# Altium schematic sheet OSSI-1 OBC_2.SchDoc: TITLE:
size 410 x 286 mm; Date: Date:; >LAST_DATE_TIME: 01/11/2015 13:38:44; Sheet:: Sheet:; >SHEET: 3; REV:: REV:; Document Number:: Document Number:; >DRAWING_NAME: OSSI-1 OBC.sch
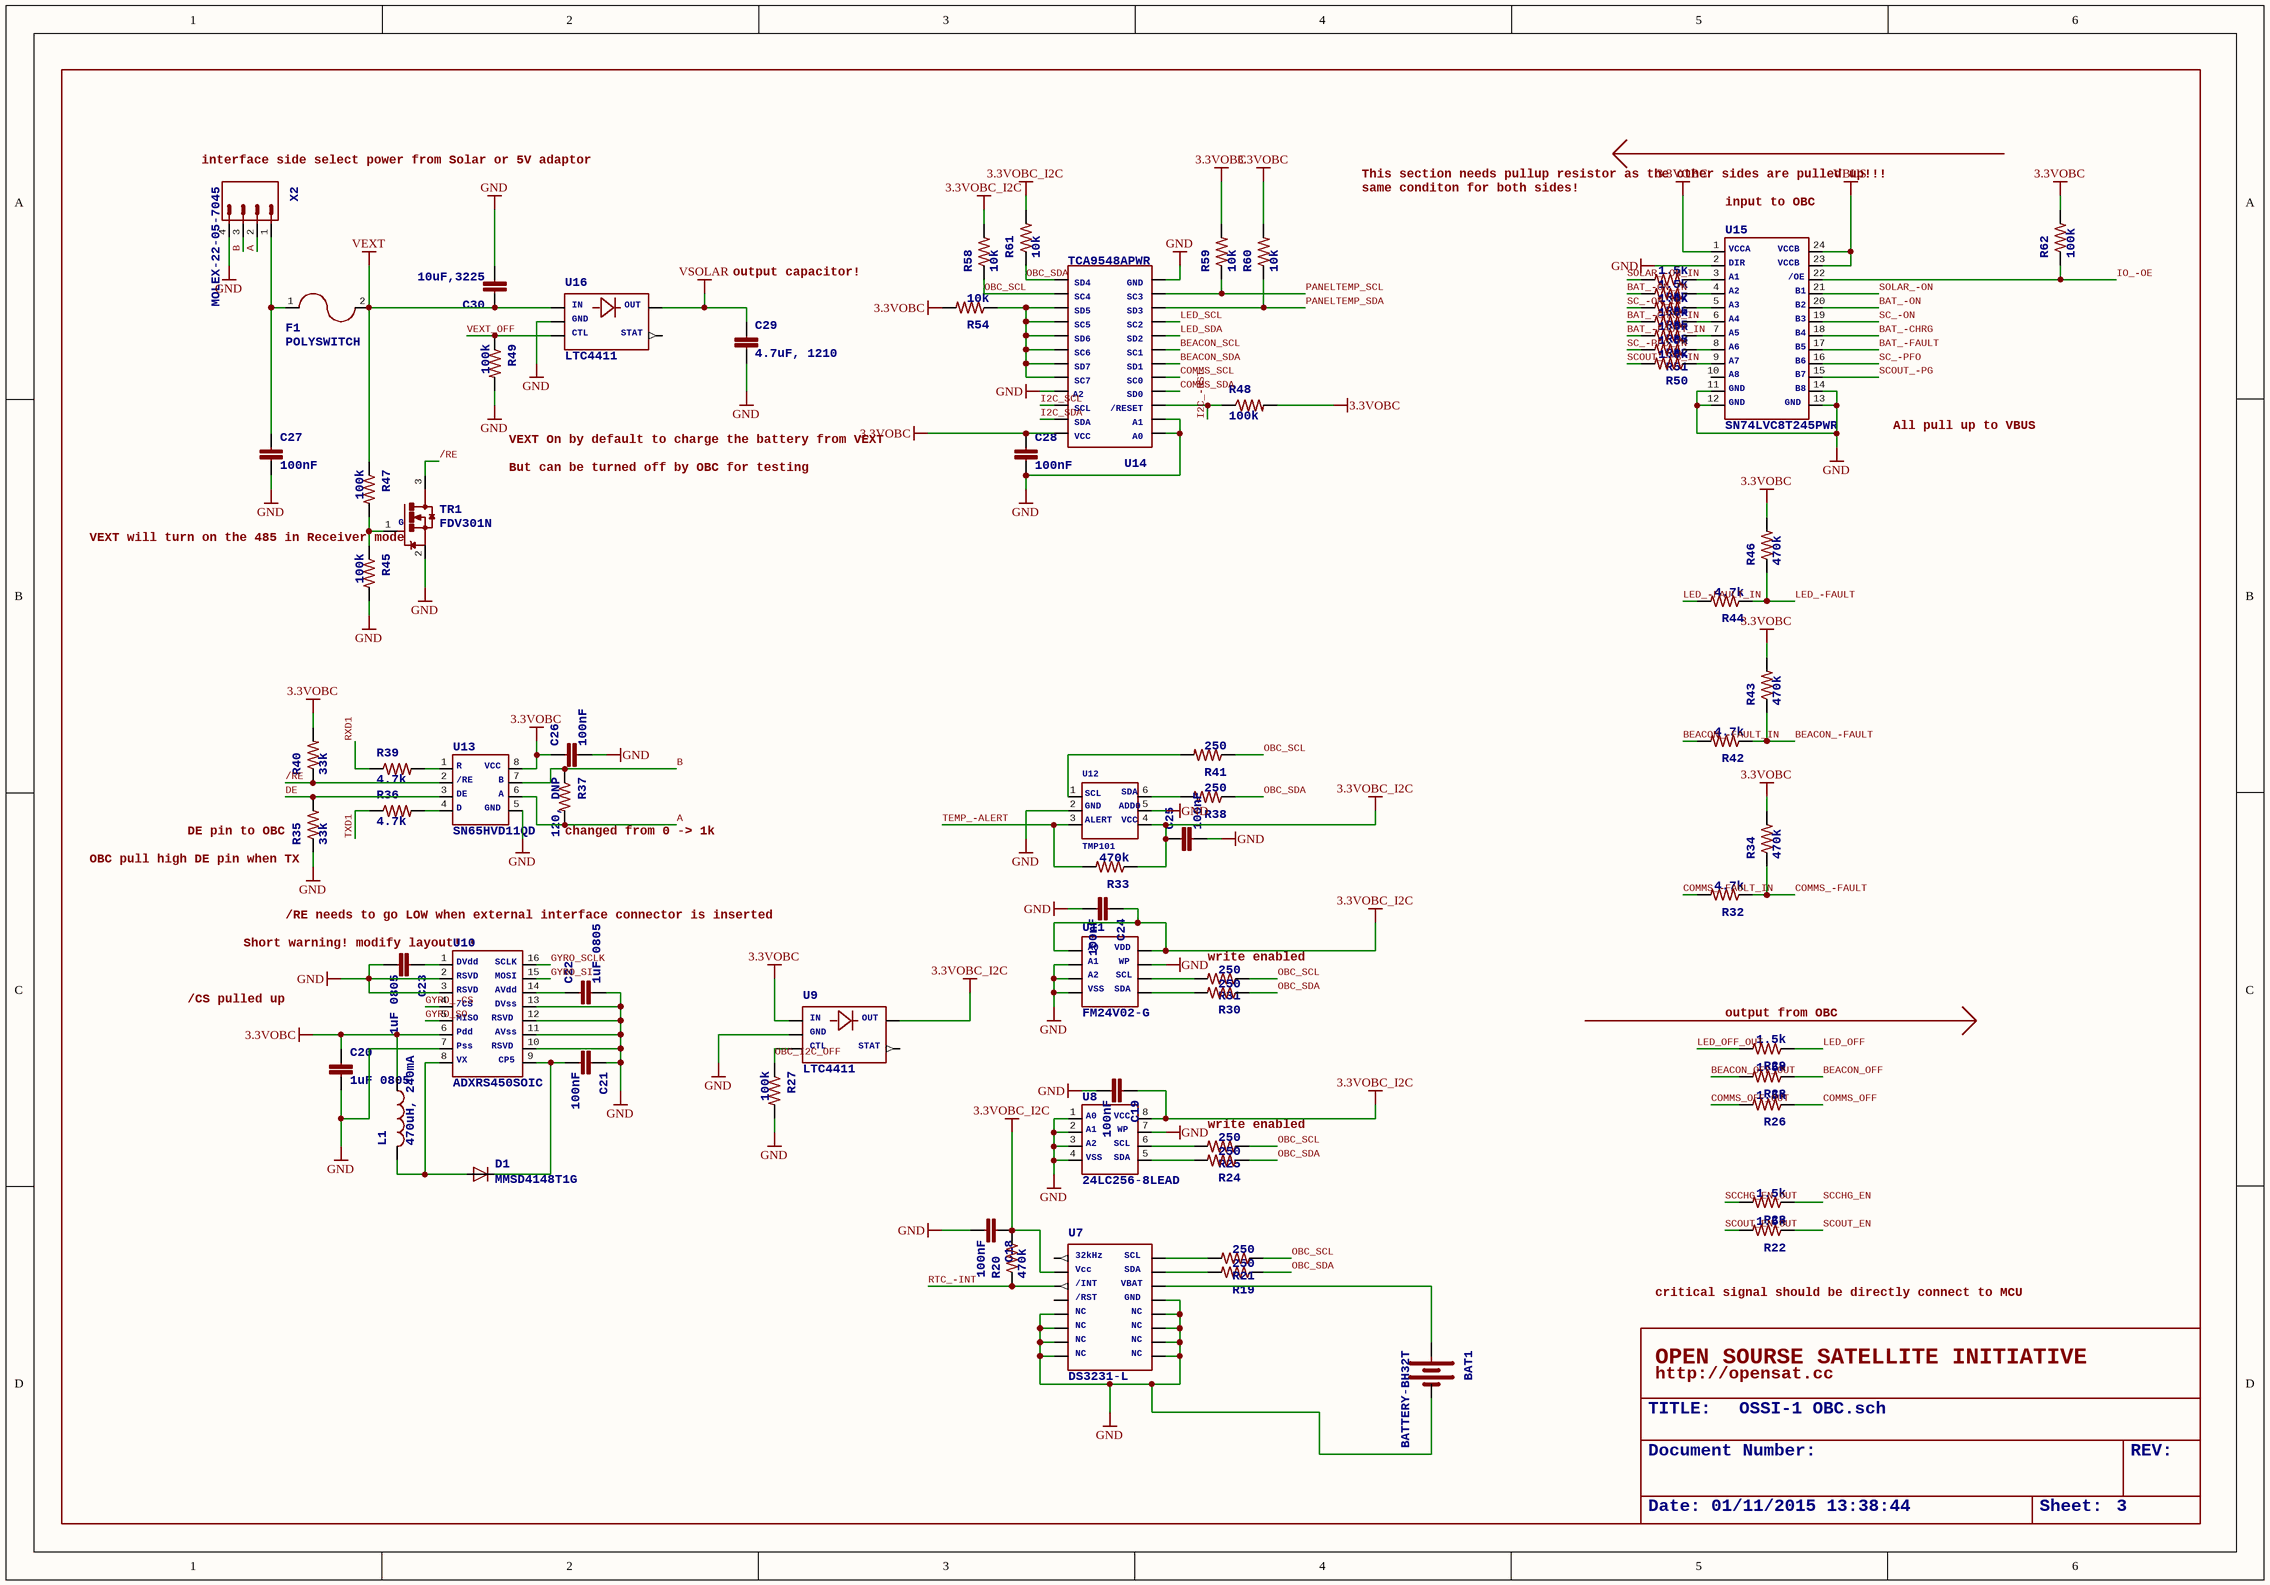
[diagram p0: OSSI-1 OBC_2.SchDoc]

## Parts
BAT1  >NAME: BAT1  [BH32T-C-G]  (hidden comment: BATTERY-BH32T)
C18  >NAME: C18  [C0603(1608)]  (hidden comment: 100nF)
C19  >NAME: C19  [C0603(1608)]  (hidden comment: 100nF)
C20  >NAME: C20  [C0805(2012)]  (hidden comment: 1uF 0805)
C21  >NAME: C21  [C0603(1608)]  (hidden comment: 100nF)
C22  >NAME: C22  [C0805(2012)]  (hidden comment: 1uF 0805)
C23  >NAME: C23  [C0805(2012)]  (hidden comment: 1uF 0805)
C24  >NAME: C24  [C0603(1608)]  (hidden comment: 100nF)
C25  >NAME: C25  [C0603(1608)]  (hidden comment: 100nF)
C26  >NAME: C26  [C0603(1608)]  (hidden comment: 100nF)
C27  >NAME: C27  [C0603(1608)]  (hidden comment: 100nF)
C28  >NAME: C28  [C0603(1608)]  (hidden comment: 100nF)
C29  >NAME: C29  [C1206-GCM31]  (hidden comment: 4.7uF, 1210)
C30  >NAME: C30  [C1210-GCM32]  (hidden comment: 10uF,3225)
D1  >NAME: D1  [SOD-123]  (hidden comment: MMSD4148T1G)
F1  >NAME: F1  [NANOSMDC150FCT]  (hidden comment: POLYSWITCH)
L1  >NAME: L1  [L(2220)]  (hidden comment: 470uH, 240mA)
R19  >NAME: R19  [R0603(1608)]  (hidden comment: 250)
R20  >NAME: R20  [R0603(1608)]  (hidden comment: 470k)
R21  >NAME: R21  [R0603(1608)]  (hidden comment: 250)
R22  >NAME: R22  [R0603(1608)]  (hidden comment: 1.5k)
R23  >NAME: R23  [R0603(1608)]  (hidden comment: 1.5k)
R24  >NAME: R24  [R0603(1608)]  (hidden comment: 250)
R25  >NAME: R25  [R0603(1608)]  (hidden comment: 250)
R26  >NAME: R26  [R0603(1608)]  (hidden comment: 1.5k)
R27  >NAME: R27  [R0603(1608)]  (hidden comment: 100k)
R28  >NAME: R28  [R0603(1608)]  (hidden comment: 1.5k)
R29  >NAME: R29  [R0603(1608)]  (hidden comment: 1.5k)
R30  >NAME: R30  [R0603(1608)]  (hidden comment: 250)
R31  >NAME: R31  [R0603(1608)]  (hidden comment: 250)
R32  >NAME: R32  [R0603(1608)]  (hidden comment: 4.7k)
R33  >NAME: R33  [R0603(1608)]  (hidden comment: 470k)
R34  >NAME: R34  [R0603(1608)]  (hidden comment: 470k)
R35  >NAME: R35  [R0603(1608)]  (hidden comment: 33k)
R36  >NAME: R36  [R0603(1608)]  (hidden comment: 4.7k)
R37  >NAME: R37  [R0603(1608)]  (hidden comment: 120, DNP)
R38  >NAME: R38  [R0603(1608)]  (hidden comment: 250)
R39  >NAME: R39  [R0603(1608)]  (hidden comment: 4.7k)
R40  >NAME: R40  [R0603(1608)]  (hidden comment: 33k)
R41  >NAME: R41  [R0603(1608)]  (hidden comment: 250)
R42  >NAME: R42  [R0603(1608)]  (hidden comment: 4.7k)
R43  >NAME: R43  [R0603(1608)]  (hidden comment: 470k)
R44  >NAME: R44  [R0603(1608)]  (hidden comment: 4.7k)
R45  >NAME: R45  [R0603(1608)]  (hidden comment: 100k)
R46  >NAME: R46  [R0603(1608)]  (hidden comment: 470k)
R47  >NAME: R47  [R0603(1608)]  (hidden comment: 100k)
R48  >NAME: R48  [R0603(1608)]  (hidden comment: 100k)
R49  >NAME: R49  [R0603(1608)]  (hidden comment: 100k)
R50  >NAME: R50  [R0603(1608)]  (hidden comment: 1.5k)
R51  >NAME: R51  [R0603(1608)]  (hidden comment: 1.5k)
R52  >NAME: R52  [R0603(1608)]  (hidden comment: 1.5k)
R53  >NAME: R53  [R0603(1608)]  (hidden comment: 1.5k)
R54  >NAME: R54  [R0603(1608)]  (hidden comment: 10k)
R55  >NAME: R55  [R0603(1608)]  (hidden comment: 1.5k)
R56  >NAME: R56  [R0603(1608)]  (hidden comment: 1.5k)
R57  >NAME: R57  [R0603(1608)]  (hidden comment: 1.5k)
R58  >NAME: R58  [R0603(1608)]  (hidden comment: 10k)
R59  >NAME: R59  [R0603(1608)]  (hidden comment: 10k)
R60  >NAME: R60  [R0603(1608)]  (hidden comment: 10k)
R61  >NAME: R61  [R0603(1608)]  (hidden comment: 10k)
R62  >NAME: R62  [R0603(1608)]  (hidden comment: 100k)
TR1  >NAME: TR1  [SOT23]  (hidden comment: FDV301N)
U7  >NAME: U7  [SO16L]  (hidden comment: DS3231-L)
U8  >NAME: U8  [SO08-208]  (hidden comment: 24LC256-8LEAD)
U9  >NAME: U9  [TSOT23-5]  (hidden comment: LTC4411)
U10  >NAME: U10  [SOIC-16CAV]  (hidden comment: ADXRS450SOIC)
U11  >NAME: U11  [SO8]  (hidden comment: FM24V02-G)
U12  >NAME: U12  [SOT23-6DBV]  (hidden comment: TMP101)
U13  >NAME: U13  [SO8]  (hidden comment: SN65HVD11QD)
U14  >NAME: U14  [TSSOP-24-PW]  (hidden comment: TCA9548APWR)
U15  >NAME: U15  [PW_R-PDSO-G24]  (hidden comment: SN74LVC8T245PWR)
U16  >NAME: U16  [TSOT23-5]  (hidden comment: LTC4411)
X2  >NAME: X2  [22-05-7045]  (hidden comment: MOLEX-22-05-7045)

## Nets
3.3VOBC: C20.1 C26.1 C28.1 L1.P$1 R34.2 R40.2 R43.2 R46.2 R48.2 R54.2 R59.2 R60.2 R62.2 U9.P$1 U10.6(P$6) U13.8(P$8) U14.24(P$24) U15.1(P$1)
3.3VOBC_I2C: C18.1 C19.1 C24.1 C25.1 R20.2 R33.1 R58.2 R61.2 U7.2(P$2) U8.8(P$8) U9.P$5 U11.1(A0) U11.8(VDD) U12.4
GND: BAT1.N(-) C18.2 C19.2 C20.2 C21.1 C22.2 C23.2 C24.2 C25.2 C26.2 C27.2 C28.2 C29.P$2 C30.P$2 R27.2 R35.1 R45.2 R49.2 TR1.2(S) U7.5(P$5) U7.6(P$6) U7.7(P$7) U7.8(P$8) U7.9(P$9) U7.10(P$10) U7.11(P$11) U7.12(P$12) U7.13(P$13) U8.1(P$1) U8.2(P$2) U8.3(P$3) U8.4(P$4) U8.7(P$7) U9.P$2 U10.2(P$2) U10.3(P$3) U10.7(P$7) U10.10(P$10) U10.11(P$11) U10.12(P$12) U10.13(P$13) U11.2(A1) U11.3(A2) U11.4(VSS) U11.7(WP) U12.2 U12.5 U13.5(P$5) U14.1(P$1) U14.2(P$2) U14.12(P$12) U14.21(P$21) U15.2(P$2) U15.11(P$11) U15.12(P$12) U15.13(P$13) U15.14(P$14) U16.P$2 X2.4
VBUS: U15.23(P$23) U15.24(P$24)
VEXT: C30.P$1 F1.2(P$2) R47.1 U16.P$1
VSOLAR: C29.P$1 U16.P$5
/RE: R40.1 TR1.3(D) U13.2(P$2)
A: R37.2 U13.6(P$6) X2.2
B: R37.1 U13.7(P$7) X2.3
BAT_-CHRG: U15.18(P$18)
BAT_-CHRG_IN: R53.2
BAT_-FAULT: U15.17(P$17)
BAT_-FAULT_IN: R52.2
BAT_-ON: U15.20(P$20)
BAT_-ON_IN: R56.2
BEACON_-FAULT: R42.1 R43.1
BEACON_-FAULT_IN: R42.2
BEACON_OFF: R28.1
BEACON_OFF_OUT: R28.2
BEACON_SCL: U14.7(P$7)
BEACON_SDA: U14.6(P$6)
COMMS_-FAULT: R32.1 R34.1
COMMS_-FAULT_IN: R32.2
COMMS_OFF: R26.1
COMMS_OFF_OUT: R26.2
COMMS_SCL: U14.5(P$5)
COMMS_SDA: U14.4(P$4)
DE: R35.2 U13.3(P$3)
GYRO_-CS: U10.4(P$4)
GYRO_SCLK: U10.16(P$16)
GYRO_SI: U10.15(P$15)
GYRO_SO: U10.5(P$5)
I2C_-RST: R48.1 U14.3(P$3)
I2C_SCL: U14.22(P$22)
I2C_SDA: U14.23(P$23)
IO_-OE: R62.1 U15.22(P$22)
LED_-FAULT: R44.1 R46.1
LED_-FAULT_IN: R44.2
LED_OFF: R29.1
LED_OFF_OUT: R29.2
LED_SCL: U14.9(P$9)
LED_SDA: U14.8(P$8)
OBC_I2C_OFF: R27.1 U9.P$3
OBC_SCL: R21.1 R25.1 R31.1 R41.1 R58.1 U14.14(P$14)
OBC_SDA: R19.1 R24.1 R30.1 R38.1 R61.1 U14.13(P$13)
PANELTEMP_SCL: R59.1 U14.11(P$11)
PANELTEMP_SDA: R60.1 U14.10(P$10)
RTC_-INT: R20.1 U7.3(P$3)
RXD1: R39.1
SC_-ON: U15.19(P$19)
SC_-ON_IN: R55.2
SC_-PFO: U15.16(P$16)
SC_-PFO_IN: R51.2
SCCHG_EN: R23.1
SCCHG_EN_OUT: R23.2
SCOUT_-PG: U15.15(P$15)
SCOUT_-PG_IN: R50.2
SCOUT_EN: R22.1
SCOUT_EN_OUT: R22.2
SOLAR_-ON: U15.21(P$21)
SOLAR_-ON_IN: R57.2
TEMP_-ALERT: R33.2 U12.3
TXD1: R36.1
VEXT_OFF: R49.1 U16.P$3
NetBAT1_P: BAT1.P(+) U7.14(P$14)
NetC21_2: C21.2 D1.C U10.9(P$9)
NetC22_1: C22.1 U10.14(P$14)
NetC23_1: C23.1 U10.1(P$1)
NetC27_1: C27.1 F1.1(P$1) X2.1
NetD1_A: D1.A L1.P$2 U10.8(P$8)
NetR19_2: R19.2 U7.15(P$15)
NetR21_2: R21.2 U7.16(P$16)
NetR24_2: R24.2 U8.5(P$5)
NetR25_2: R25.2 U8.6(P$6)
NetR30_2: R30.2 U11.5(SDA)
NetR31_2: R31.2 U11.6(SCL)
NetR36_2: R36.2 U13.4(P$4)
NetR38_2: R38.2 U12.6
NetR39_2: R39.2 U13.1(P$1)
NetR41_2: R41.2 U12.1
NetR45_1: R45.1 R47.2 TR1.1(G)
NetR50_1: R50.1 U15.9(P$9)
NetR51_1: R51.1 U15.8(P$8)
NetR52_1: R52.1 U15.7(P$7)
NetR53_1: R53.1 U15.6(P$6)
NetR54_1: R54.1 U14.15(P$15) U14.16(P$16) U14.17(P$17) U14.18(P$18) U14.19(P$19) U14.20(P$20)
NetR55_1: R55.1 U15.5(P$5)
NetR56_1: R56.1 U15.4(P$4)
NetR57_1: R57.1 U15.3(P$3)

Not connected (* = marked no-connect by the designer): U7 1(P$1) 4(P$4); U9 P$4; U15 10(P$10); U16 P$4

## Notes on the sheet
- interface side select power from Solar or 5V adaptor
- This section needs pullup resistor as the other sides are pulled up!!!
- same conditon for both sides!
- (near U15) input to OBC
- output capacitor!
- VEXT On by default to charge the battery from VEXT
- But can be turned off by OBC for testing
- All pull up to VBUS
- VEXT will turn on the 485 in Receiver mode
- (near R35) DE pin to OBC
- (near R37) changed from 0 -> 1k
- (near R35) OBC pull high DE pin when TX
- Short warning! modify layout!!!
- /RE needs to go LOW when external interface connector is inserted
- (near R31) write enabled
- /CS pulled up
- (near R29) output from OBC
- (near R25) write enabled
- critical signal should be directly connect to MCU
- OPEN SOURSE SATELLITE INITIATIVE
- http://opensat.cc

## Library data of the parts
C18 C19 C21 C24-C28 = C0603(1608): >VALUE: 100nF
C20 C22 C23 = C0805(2012): >VALUE: 1uF 0805
C29 = C1206(3216)-GCM31: >VALUE: 4.7uF, 1210
C30 = C1210(3225)-GCM32: >VALUE: 10uF,3225
F1 = POLYSWITCH: Resettable Polyswitch; >VALUE: POLYSWITCH
L1 = LQH55: >VALUE: 470uH, 240mA
R19-R62 = R0603(1608)
  R19 R21 R24 R25 R30 R31 R38 R41: >VALUE: 250
  R20 R33 R34 R43 R46: >VALUE: 470k
  R22 R23 R26 R28 R29 R50-R53 R55-R57: >VALUE: 1.5k
  R27 R45 R47-R49 R62: >VALUE: 100k
  R32 R36 R39 R42 R44: >VALUE: 4.7k
  R35 R40: >VALUE: 33k
  R37: >VALUE: 120, DNP
  R54 R58-R61: >VALUE: 10k
TR1 = FDV301N: FDV301N Digital N channel - FET / Rdson = 5 Ohm / Vgs = 0.7~1.06V / Ids = 220mA; G: G; >VALUE: FDV301N
U7 = DS3231-L: <b>DS3231</b> / <br /> / Extremely Accureate I2C integrated RTC/TCXO/Crystal by MAXIM; 32kHz: 32kHz; Vcc: Vcc; /INT: /INT; /RST: /RST; NC: NC; GND: GND; VBAT: VBAT; SDA: SDA; SCL: SCL; >VALUE: DS3231-L
U8 = 24LC256-8LEAD: 24LC256<BR/> / 256K I2C™ CMOS Serial EEPROM; >VALUE: 24LC256-8LEAD; A0: A0; A1: A1; A2: A2; VSS: VSS; VCC: VCC; WP: WP; SCL: SCL; SDA: SDA
U9 U16 = LTC4411: <b>Linear Techonology LTC4411 ideal diode</b> / <ul> / <li>Small Regulated Forward Voltage (28mV)</li> / <li>2.6A Maximum Forward Current</li> / <li>2.6V to 5.5V Operating Range</li> / <li>MOSFET based</li> / </ul>; IN: IN; GND: GND; CTL: CTL; OUT: OUT; STAT: STAT; >VALUE: LTC4411
U11 = FM24V02-G: <b>FM24V02</b> / <br /> / 256Kb Serial 3V F-RAM Memory by RAMTRON; A0: A0; A1: A1; A2: A2; VSS: VSS; SDA: SDA; SCL: SCL; WP: WP; VDD: VDD; >VALUE: FM24V02-G
U12 = TMP101: TMP101 Digital Temerature Sensor with I2C Interface from Texas Instruments with Alert Function; >VALUE: TMP101; VCC: VCC; SCL: SCL; SDA: SDA; GND: GND; ADD0: ADD0; ALERT: ALERT
U13 = SN65HVD11QD: SN65HVD11 3.3V RS485 Transceiver <br /> / QD: -40~+125; >VALUE: SN65HVD11QD; R: R; /RE: /RE; DE: DE; D: D; VCC: VCC; B: B; A: A; GND: GND
U14 = PCA9548APWR: <b>PCA9548APWR</b> / <ul> / <li>8-Channel I2C Switch With Reset </li> / <li>1-of-8 Bidirectional Translating Switches</li> / <li></li> / <li>Address by Three Hardware Address Pins for Use of up to Eight Devices</li> / <li>Operating Power: 2.3 V to 5.5 V</li> / <li>Active-Low Reset Input</li> / </ul>; >VALUE: TCA9548APWR; A0: A0; A1: A1; /RESET: /RESET; SD0: SD0; SC0: SC0; SD1: SD1; SC1: SC1; SD2: SD2; SC2: SC2; SD3: SD3; SC3: SC3; GND: GND; SD4: SD4; SC4: SC4; SD5: SD5; SC5: SC5; SD6: SD6; SC6: SC6; SD7: SD7; SC7: SC7; A2: A2; SCL: SCL; SDA: SDA; VCC: VCC
U15 = SN74LVC8T245PWR: SN74LVC8T245<BR/> / 8-BIT DUAL-SUPPLY BUS TRANSCEIVER / WITH CONFIGURABLE VOLTAGE TRANSLATION AND 3-STATE OUTPUTS; >VALUE: SN74LVC8T245PWR; VCCA: VCCA; DIR: DIR; A1: A1; A2: A2; A3: A3; A4: A4; A5: A5; A6: A6; A7: A7; A8: A8; GND: GND; B1: B1; VCCB: VCCB; /OE: /OE; B2: B2; B3: B3; B4: B4; B5: B5; B6: B6; B7: B7; B8: B8
X2 = MOLEX-22-05-7045: molex spoxt 5268 series 22-05-7045 for external interface; >VALUE: MOLEX-22-05-7045
BAT1 = BATTERY-BH32T: >VALUE: BATTERY-BH32T
D1 = MMSD4148T1G: >VALUE: MMSD4148T1G
U10 = ADXRS450SOIC: >VALUE: ADXRS450SOIC; DVdd: DVdd; RSVD: RSVD; /CS: /CS; MISO: MISO; Pdd: Pdd; Pss: Pss; VX: VX; CP5: CP5; AVss: AVss; DVss: DVss; AVdd: AVdd; MOSI: MOSI; SCLK: SCLK